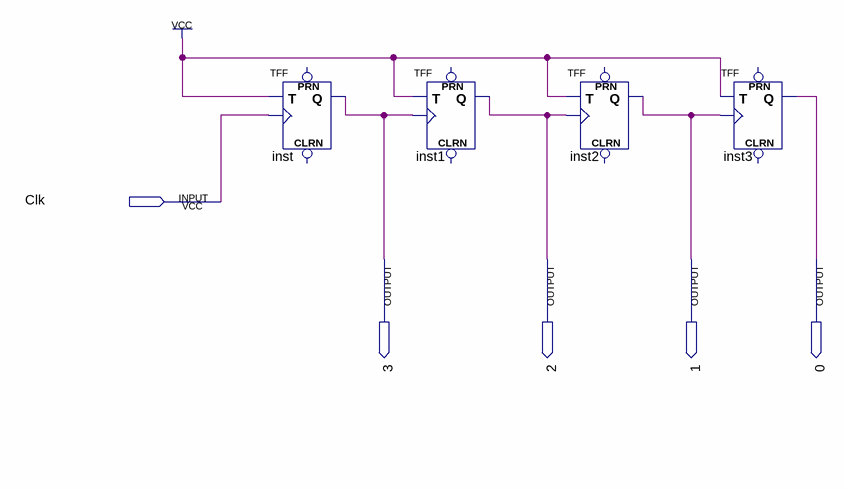
[diagram p0: schematic sheet]
// Quartus schematic ContadorCompleto15bits.bdf as structural Verilog: 4 symbols, 5 pins
module ContadorCompleto15bits (
  input  Clk,
  output \3 ,
  output \2 ,
  output \1 ,
  output \0 
);

  TFF inst (.T(1'b1), .CLK(Clk), .Q(\3 ));  // open: PRN, CLRN
  TFF inst1 (.T(1'b1), .CLK(\3 ), .Q(\2 ));  // open: PRN, CLRN
  TFF inst2 (.T(1'b1), .CLK(\2 ), .Q(\1 ));  // open: PRN, CLRN
  TFF inst3 (.T(1'b1), .CLK(\1 ), .Q(\0 ));  // open: PRN, CLRN
endmodule
